# EasyEDA Pro project ProPrj_photodigm_mount_DB15_Edited_2025-06-26.epro

# Schematic photodigm_mount_DB15
Board Name: photodigm_mount_DB15; Create Date: 2025-06-18; Page Name: photodigm_mount_DB15; Project Name: photodigm_mount_DB15_Edited; Schematic Name: photodigm_mount_DB15; Update Date: 2025-06-19; File: photodigm_mount_DB15; Id: /; Sheet: /
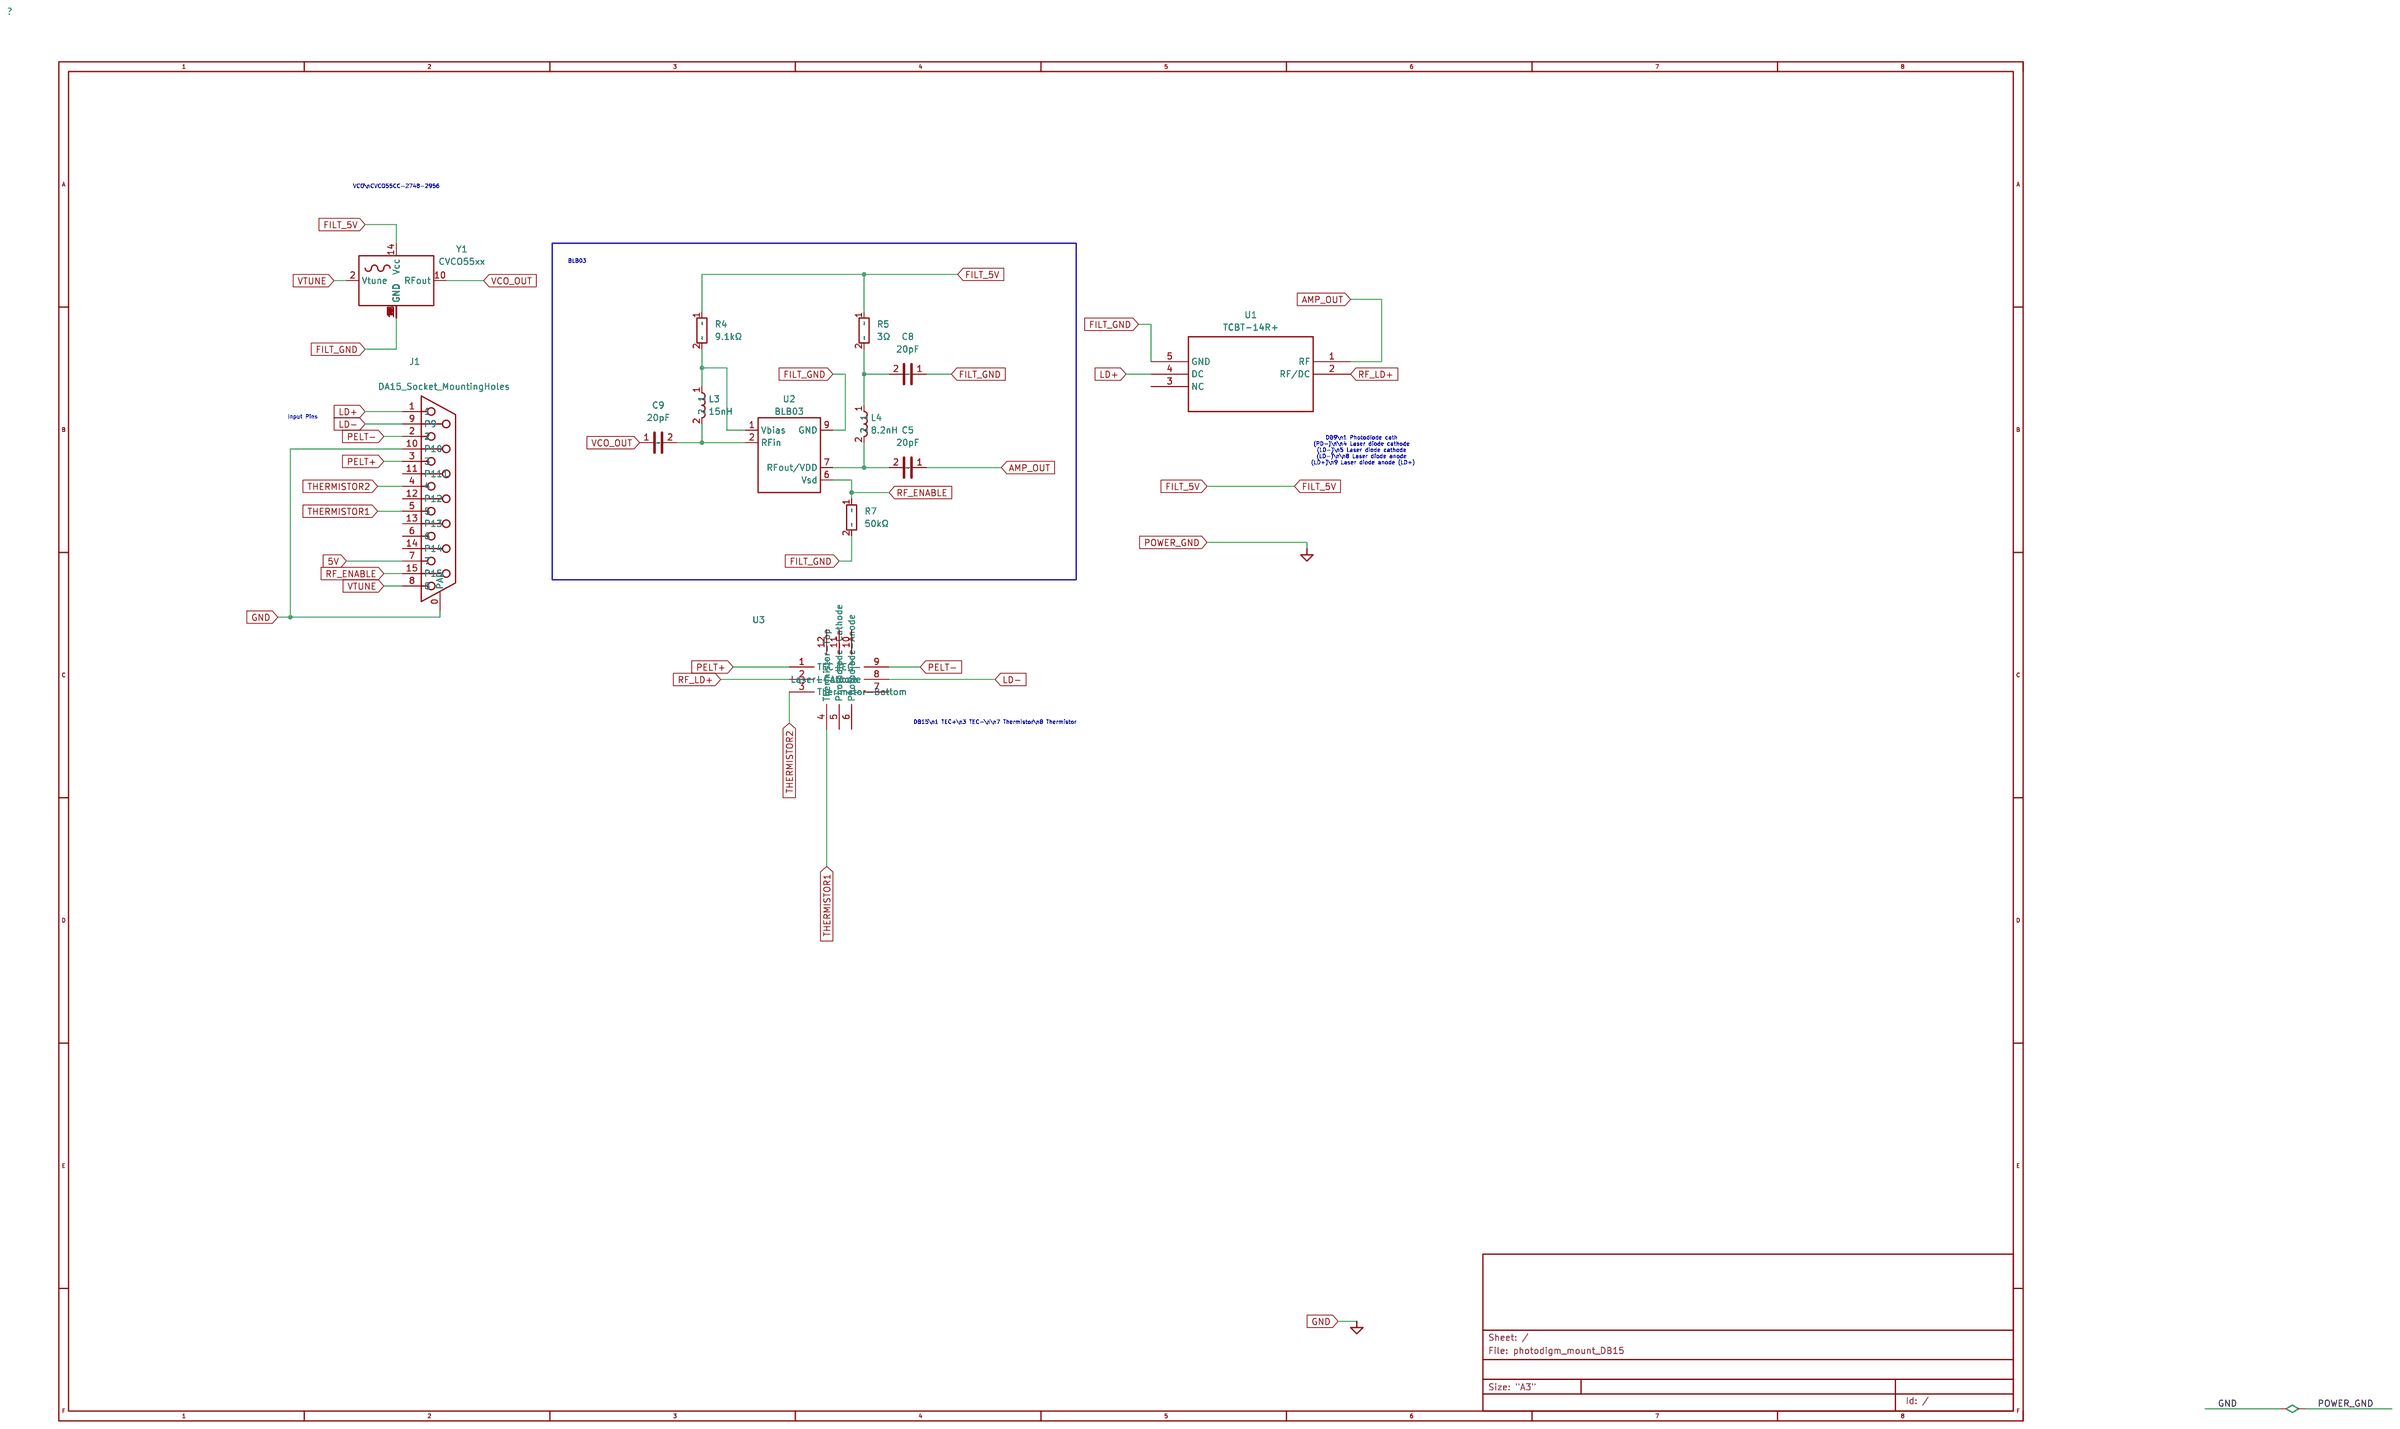
[diagram p0: schematic sheet]

## Parts
C5  20pF  [Capacitor_SMD:C_0402_1005Metric]
C8  20pF  [Capacitor_SMD:C_0402_1005Metric]
C9  20pF  [Capacitor_SMD:C_0402_1005Metric]
J1  DA15_Socket_MountingHoles  [Connector_Dsub:DSUB-15_Socket_Vertical_P2.77x2.84mm_MountingHoles]
L3  15nH  [Inductor_SMD:L_0603_1608Metric]
L4  8.2nH  [Inductor_SMD:L_0603_1608Metric]
R4  9.1kΩ  [Resistor_SMD:R_0402_1005Metric]
R5  3Ω  [Resistor_SMD:R_0402_1005Metric]
R7  50kΩ  [Resistor_SMD:R_0402_1005Metric]
U1  TCBT-14R+  [TCBT-14R+:GU1414-2_MNC]
U2  BLB03  [Package_DFN_QFN:DFN-8-1EP_2x2mm_P0.5mm_EP0.6x1.2mm]
U3  -  [LaserDiode]
Y1  CVCO55xx  [CVCO55CC-2745-2860:CVCO55CC-2745-2860_CRX-L]

## Library data of the parts
C5 C8 C9 = Device_C: Unpolarized capacitor; Users: REF**
J1 = Connector_DA15_Socket_MountingHoles: 15-pin D-SUB connector, socket (female) (low-density/2 columns), Mounting Hole; Users: REF**
L3 L4 = Device_L: Inductor; Users: REF**
R4 R5 R7 = Device_R: Resistor; Users: REF**
U1 = TCBT-14R+_TCBT-14R+: Users: REF**
U2 = andysymbols_BLB03: Users: REF**
U3 = LaserDiode: The pinout mapping to the laser diode is detailed here: / https://docs.google.com/document/d/1F_GS5lQfQVxQtG2fh0W02aLKUGq1590sdO3nVdWIJyE/edit?tab=t.0
Y1 = Oscillator_CVCO55xx: Voltage Controlled Oscillator, Crystek, 0.50\" SQ SMD; Users: *; datasheet: https://www.crystek.com/home/vco/cvco55.aspx; User doc link: https://www.crystek.com/home/vco/cvco55.aspx

## Nets
5V: J1.7
AMP_OUT: C5.1 U1.1(RF)
FILT_5V: R4.1 R5.1 Y1.14(Vcc)
FILT_GND: C8.1 R7.2 U1.5(GND) U2.9(GND) Y1.1(GND) Y1.3(GND) Y1.4(GND) Y1.5(GND) Y1.6(GND) Y1.7(GND) Y1.8(GND) Y1.9(GND) Y1.11(GND) Y1.12(GND) Y1.13(GND) Y1.15(GND) Y1.16(GND)
LD+: J1.1 U1.4(DC)
LD-: J1.9(P9) U3.8(Laser-Cathode)
PELT+: J1.3 U3.1(TEC+)
PELT-: J1.2 U3.9(TEC-)
POWER_GND: J1.0(PAD) J1.10(P10)
RF_ENABLE: J1.15(P15) R7.1 U2.6(Vsd)
RF_LD+: U1.2(RF/DC) U3.2(L-Anode)
THERMISTOR1: J1.5 U3.4(Thermistor-Top)
THERMISTOR2: J1.4 U3.3(Therimstor-Bottom)
VCO_OUT: C9.1 Y1.10(RFout)
VTUNE: J1.8 Y1.2(Vtune)
$1N4: C9.2 L3.2 U2.2(RFin)
$1N8: C8.2 L4.1 R5.2
$1N12: L3.1 R4.2 U2.1(Vbias)
$1N19: C5.2 L4.2 U2.7(RFout/VDD)

Not connected (* = marked no-connect by the designer): J1 6 11(P111) 12(P12) 13(P13) 14(P14); U1 3(NC); U3 5(Photodiode-Cathode) 6(Photodiode-Anode) 7(--) 10(--) 11(--) 12(--)

## Notes on the sheet
- VCO\nCVCO55CC-2748-2956
- BLB03
- Input Pins
- DB9\n1 Photodiode cath
  (PD-)\n\n4 Laser diode cathode
  (LD-)\n5 Laser diode cathode
  (LD-)\n\n8 Laser diode anode
  (LD+)\n9 Laser diode anode (LD+)
- DB15\n1 TEC+\n3 TEC-\n\n7 Thermistor\n8 Thermistor

# Board photodigm_mount_DB15
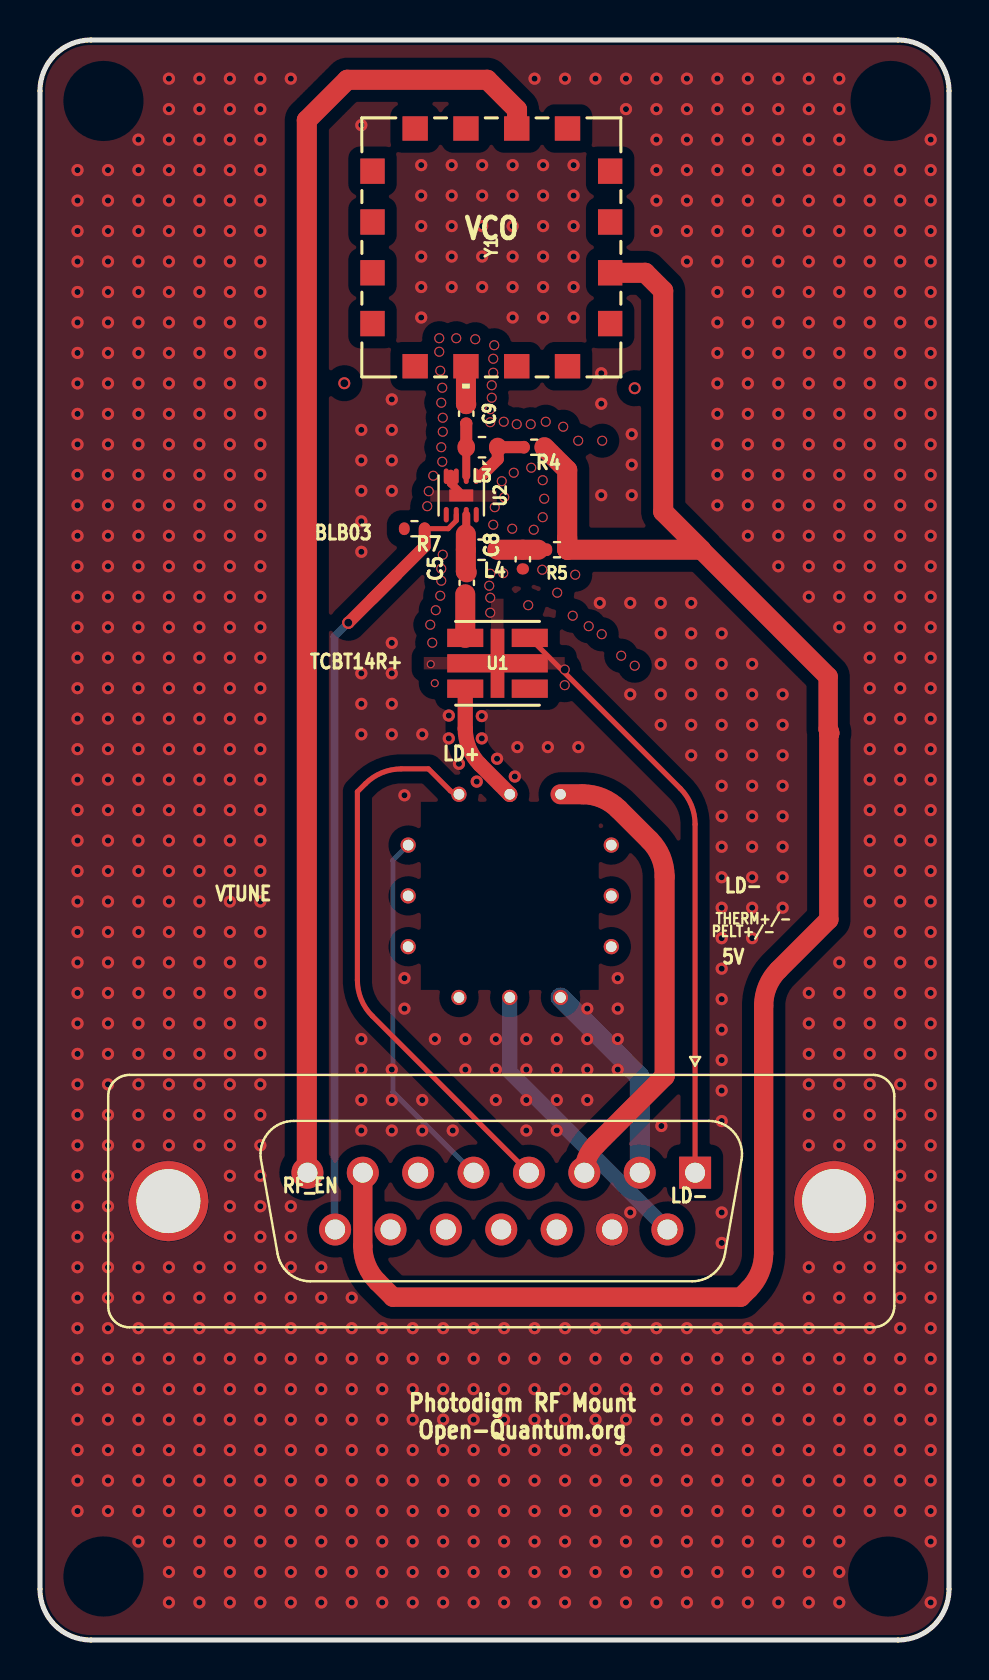
[diagram p1: board, top side]
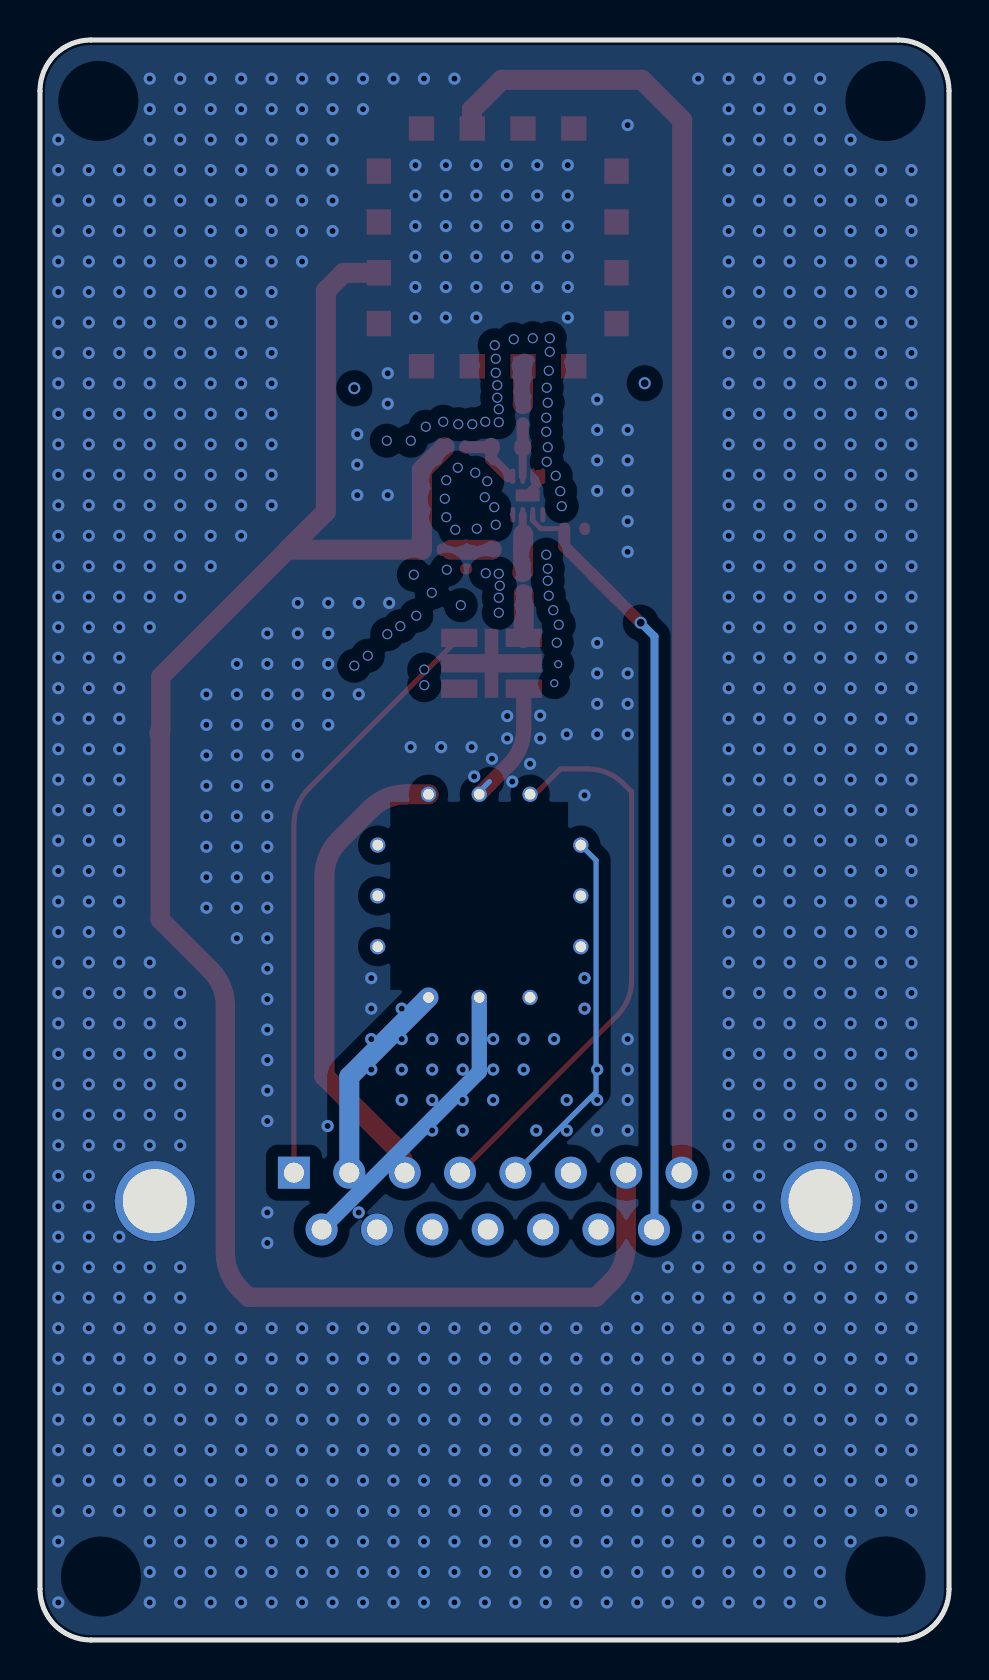
[diagram p2: board, bottom side, seen from below]

Outline 45.47 x 80.01 mm; copper layers: Top Layer, Bottom Layer. Coordinates in mm from the lower left corner of the outline.
Outline path: 0,77.47 0,2.54 arc(0.74,0.74) 2.54,0 42.93,0 arc(44.72,0.74) 45.47,2.54 45.47,77.47 arc(44.72,79.27) 42.93,80.01 2.54,80.01 arc(0.74,79.27) 0,77.47
Stack: Top Layer 0.035mm / Dielectric1 1.51mm FR4 er 4.5 / Bottom Layer 0.035mm

## Design rules (mm)
template: User Custom Config
spacing safeClearance (default): track to track 0, other pairs 0 to 0.051
track width trackWidth (default): min 0.127, default 0.254, max 2.54
differential pair differentialPair (default): width min 0.127, default 0.254, max 2.54; gap min 0.152, default 0.152
via viaSize (default): diameter min 0.5, default 0.61, max 10; hole min 0.3, default 0.305, max 5.999
net filt_gnd uses CopperRegion1

## Placement (name value [footprint] x y rotation side)
C5  20pF  [Capacitor_SMD:C_0402_1005Metric]  21.34 52.87 90 top
C8  20pF  [Capacitor_SMD:C_0402_1005Metric]  24.15 54.04 90 top
C9  20pF  [Capacitor_SMD:C_0402_1005Metric]  21.32 61.32 270 top
J1  DA15_Socket_MountingHoles  [Connector_Dsub:DSUB-15_Socket_Vertical_P2.77x2.84mm_MountingHoles]  32.77 23.37 0 top
L3  15nH  [Inductor_SMD:L_0603_1608Metric]  22.11 59.65 180 top
L4  8.2nH  [Inductor_SMD:L_0603_1608Metric]  22.09 54.52 180 top
R4  9.1kΩ  [Resistor_SMD:R_0402_1005Metric]  24.72 59.65 180 top
R5  3Ω  [Resistor_SMD:R_0402_1005Metric]  25.86 54.52 180 top
R7  50kΩ  [Resistor_SMD:R_0402_1005Metric]  18.73 55.57 180 top
U1  TCBT-14R+  [TCBT-14R+:GU1414-2_MNC]  22.88 48.84 0 top
U2  BLB03  [Package_DFN_QFN:DFN-8-1EP_2x2mm_P0.5mm_EP0.6x1.2mm]  21.07 57.23 270 top
U3  -  [LaserDiode]  16.38 45.34 270 top
Y1  CVCO55xx  [CVCO55CC-2745-2860:CVCO55CC-2745-2860_CRX-L]  22.58 69.64 270 top

## Footprints (pads in the part's own frame, mm; a bottom-side part is the same pattern mirrored in y, then rotated)
Capacitor_SMD:C_0402_1005Metric
  rrect 0.56x0.62 smd: 1(-0.48,0) 2(0.48,0)
Connector_Dsub:DSUB-15_Socket_Vertical_P2.77x2.84mm_MountingHoles
  round 4 hole 3.2: 0(-26.345,-1.42) 0(6.955,-1.42)
  rect 1.6x1.6 hole 1: 1(0,0)
  round 1.6 hole 1: 2(-2.77,0) 3(-5.54,0) 4(-8.31,0) 5(-11.08,0) 6(-13.85,0) 7(-16.62,0) 8(-19.39,0) 9(-1.385,-2.84) 10(-4.155,-2.84) 11(-6.925,-2.84) 12(-9.695,-2.84) 13(-12.465,-2.84) 14(-15.235,-2.84) 15(-18.005,-2.84)
CVCO55CC-2745-2860:CVCO55CC-2745-2860_CRX-L
  rect 1.219x1.27 smd: 1(-5.944,3.81) 2(-5.944,1.27) 3(-5.944,-1.27) 4(-5.944,-3.81) 9(5.944,-3.81) 10(5.944,-1.27) 11(5.944,1.27) 12(5.944,3.81)
  rect 1.27x1.219 smd: 5(-3.81,-5.944) 6(-1.27,-5.944) 7(1.27,-5.944) 8(3.81,-5.944) 13(3.81,5.944) 14(1.27,5.944) 15(-1.27,5.944) 16(-3.81,5.944)
Inductor_SMD:L_0603_1608Metric
  rrect 0.875x0.95 smd: 1(-0.787,0) 2(0.787,0)
LaserDiode
  round 0.762 hole 0.533: 1(3.048,9.652) 2(3.048,7.112) 3(3.048,4.572) 4(5.588,2.032) 5(8.128,2.032) 6(10.668,2.032) 7(13.208,4.572) 8(13.208,7.112) 9(13.208,9.652) 10(10.668,12.192) 11(8.128,12.192) 12(5.588,12.192)
Package_DFN_QFN:DFN-8-1EP_2x2mm_P0.5mm_EP0.6x1.2mm
  rrect 0.24x0.48 smd: (-0.15,0.3) (-0.15,-0.3) (0.15,0.3) (0.15,-0.3)
  rrect 0.775x0.25 smd: 1(-0.963,0.75) 2(-0.963,0.25) 3(-0.963,-0.25) 4(-0.963,-0.75) 5(0.963,-0.75) 6(0.963,-0.25) 7(0.963,0.25) 8(0.963,0.75)
  rect 0.6x1.2 smd: 9(0,0)
Resistor_SMD:R_0402_1005Metric
  rrect 0.54x0.64 smd: 1(-0.51,0) 2(0.51,0)
TCBT-14R+:GU1414-2_MNC
  rect 1.804x0.914 smd: 1(-1.613,1.27) 2(-1.613,-1.27) 3(1.613,-1.27) 4(1.613,1.27)
  rect 0.686x3.454 smd: 5(0,0)

## Nets
As in the schematic, except:
GND: J1.0 J1.10

Pads without a net: J1 6 11 12 13 14; U1 3; U2 3 4 5 8; U3 5 6 7 10 11 12

## Via types
v1: diameter 0.61, hole 0.305, Top Layer to Bottom Layer, 943 vias
v2: diameter 0.5, hole 0.4, Top Layer to Bottom Layer, 62 vias
v3: diameter 0.4, hole 0.3, Top Layer to Bottom Layer, 2 vias
v4: diameter 0.6, hole 0.4, Top Layer to Bottom Layer, 3 vias

## Routing (per net, layer and track width the routed paths; a pad name or vN(x,y) marks a point on that pad's centre or on a via; arc(x,y) is an arc through that point)
5V: length 94.8
  Top Layer w0.965: J1.7 16.15,19.7 arc(16.34,18.73) 16.89,17.91 17.65,17.14 35.05,17.14 35.45,17.54 arc(36,18.37) 36.2,19.34 36.2,31.71 arc(36.39,32.69) 36.94,33.51 39.45,36.03 39.45,45.3 39.5,45.34 39.5,45.36 arc(39.48,45.46) 39.42,45.55 39.42,48.17 33.07,54.52
  Top Layer w1: 25.23,59.65 26.37,58.5 26.37,54.52 33.07,54.52 31.17,56.42 31.17,67.47 30.27,68.37 28.52,68.37
GND:
  vias: v1(1.88,73.5) v1(1.88,71.98) v1(1.88,70.46) v1(1.88,68.93) v1(1.88,67.41) v1(1.88,65.88) v1(1.88,64.36) v1(1.88,62.84) v1(1.88,61.31) v1(1.88,59.79) v1(1.88,58.26) v1(1.88,56.74) v1(1.88,55.22) v1(1.88,53.69) v1(1.88,52.17) v1(1.88,50.64) v1(1.88,49.12) v1(1.88,47.6) v1(1.88,46.07) v1(1.88,44.55) v1(1.88,43.02) v1(1.88,41.5) v1(1.88,39.98) v1(1.88,38.45) v1(1.88,36.93) v1(1.88,35.4) v1(1.88,33.88) v1(1.88,32.36) v1(1.88,30.83) v1(1.88,29.31) v1(1.88,27.78) v1(1.88,26.26) v1(1.88,24.74) v1(1.88,23.21) v1(1.88,21.69) v1(1.88,20.16) v1(1.88,18.64) v1(1.88,17.12) v1(1.88,15.59) v1(1.88,14.07) v1(1.88,12.54) v1(1.88,11.02) v1(1.88,9.5) v1(1.88,7.97) v1(1.88,6.45) v1(3.4,73.5) v1(3.4,71.98) v1(3.4,70.46) v1(3.4,68.93) v1(3.4,67.41) v1(3.4,65.88) v1(3.4,64.36) v1(3.4,62.84) v1(3.4,61.31) v1(3.4,59.79) v1(3.4,58.26) v1(3.4,56.74) v1(3.4,55.22) v1(3.4,53.69) v1(3.4,52.17) v1(3.4,50.64) v1(3.4,49.12) v1(3.4,47.6) v1(3.4,46.07) v1(3.4,44.55) v1(3.4,43.02) v1(3.4,41.5) v1(3.4,39.98) v1(3.4,38.45) v1(3.4,36.93) v1(3.4,35.4) v1(3.4,33.88) v1(3.4,32.36) v1(3.4,30.83) v1(3.4,29.31) v1(3.4,27.78) v1(3.4,26.26) v1(3.4,24.74) v1(3.4,23.21) v1(3.4,21.69) v1(3.4,20.16) v1(3.4,18.64) v1(3.4,17.12) v1(3.4,15.59) v1(3.4,14.07) v1(3.4,12.54) v1(3.4,11.02) v1(3.4,9.5) v1(3.4,7.97) v1(3.4,6.45) v1(4.92,75.03) v1(4.92,73.5) v1(4.92,71.98) v1(4.92,70.46) v1(4.92,68.93) v1(4.92,67.41) v1(4.92,65.88) v1(4.92,64.36) v1(4.92,62.84) v1(4.92,61.31) v1(4.92,59.79) v1(4.92,58.26) v1(4.92,56.74) v1(4.92,55.22) v1(4.92,53.69) v1(4.92,52.17) v1(4.92,50.64) v1(4.92,49.12) v1(4.92,47.6) v1(4.92,46.07) v1(4.92,44.55) v1(4.92,43.02) v1(4.92,41.5) v1(4.92,39.98) v1(4.92,38.45) v1(4.92,36.93) v1(4.92,35.4) v1(4.92,33.88) v1(4.92,32.36) v1(4.92,30.83) v1(4.92,29.31) v1(4.92,27.78) v1(4.92,26.26) v1(4.92,24.74) v1(4.92,18.64) v1(4.92,17.12) v1(4.92,15.59) v1(4.92,14.07) v1(4.92,12.54) v1(4.92,11.02) v1(4.92,9.5) v1(4.92,7.97) v1(4.92,6.45) v1(4.92,4.92) v1(6.45,78.08) v1(6.45,76.55) v1(6.45,75.03) v1(6.45,73.5) v1(6.45,71.98) v1(6.45,70.46) v1(6.45,68.93) v1(6.45,67.41) v1(6.45,65.88) v1(6.45,64.36) v1(6.45,62.84) v1(6.45,61.31) v1(6.45,59.79) v1(6.45,58.26) v1(6.45,56.74) v1(6.45,55.22) v1(6.45,53.69) v1(6.45,52.17) v1(6.45,50.64) v1(6.45,49.12) v1(6.45,47.6) v1(6.45,46.07) v1(6.45,44.55) v1(6.45,43.02) v1(6.45,41.5) v1(6.45,39.98) v1(6.45,38.45) v1(6.45,36.93) v1(6.45,35.4) v1(6.45,33.88) v1(6.45,32.36) v1(6.45,30.83) v1(6.45,29.31) v1(6.45,27.78) v1(6.45,26.26) v1(6.45,24.74) v1(6.45,18.64) v1(6.45,17.12) v1(6.45,15.59) v1(6.45,14.07) v1(6.45,12.54) v1(6.45,11.02) v1(6.45,9.5) v1(6.45,7.97) v1(6.45,6.45) v1(6.45,4.92) v1(6.45,3.4) v1(6.45,1.88) v1(7.97,78.08) v1(7.97,76.55) v1(7.97,75.03) v1(7.97,73.5) v1(7.97,71.98) v1(7.97,70.46) v1(7.97,68.93) v1(7.97,67.41) v1(7.97,65.88) v1(7.97,64.36) v1(7.97,62.84) v1(7.97,61.31) v1(7.97,59.79) v1(7.97,58.26) v1(7.97,56.74) v1(7.97,55.22) v1(7.97,53.69) v1(7.97,52.17) v1(7.97,50.64) v1(7.97,49.12) v1(7.97,47.6) v1(7.97,46.07) v1(7.97,44.55) v1(7.97,43.02) v1(7.97,41.5) v1(7.97,39.98) v1(7.97,38.45) v1(7.97,36.93) v1(7.97,35.4) v1(7.97,33.88) v1(7.97,32.36) v1(7.97,30.83) v1(7.97,29.31) v1(7.97,27.78) v1(7.97,26.26) v1(7.97,24.74) v1(7.97,18.64) v1(7.97,17.12) v1(7.97,15.59) v1(7.97,14.07) v1(7.97,12.54) v1(7.97,11.02) v1(7.97,9.5) v1(7.97,7.97) v1(7.97,6.45) v1(7.97,4.92) v1(7.97,3.4) v1(7.97,1.88) v1(9.5,78.08) v1(9.5,76.55) v1(9.5,75.03) v1(9.5,73.5) v1(9.5,71.98) v1(9.5,70.46) v1(9.5,68.93) v1(9.5,67.41) v1(9.5,65.88) v1(9.5,64.36) v1(9.5,62.84) v1(9.5,61.31) v1(9.5,59.79) v1(9.5,58.26) v1(9.5,56.74) v1(9.5,55.22) v1(9.5,53.69) v1(9.5,52.17) v1(9.5,50.64) v1(9.5,49.12) v1(9.5,47.6) v1(9.5,46.07) v1(9.5,44.55) v1(9.5,43.02) v1(9.5,41.5) v1(9.5,39.98) v1(9.5,38.45) v1(9.5,36.93) v1(9.5,35.4) v1(9.5,33.88) v1(9.5,32.36) v1(9.5,30.83) v1(9.5,29.31) v1(9.5,27.78) v1(9.5,26.26) v1(9.5,24.74) v1(9.5,23.21) v1(9.5,21.69) v1(9.5,20.16) v1(9.5,18.64) v1(9.5,17.12) v1(9.5,15.59) v1(9.5,14.07) v1(9.5,12.54) v1(9.5,11.02) v1(9.5,9.5) v1(9.5,7.97) v1(9.5,6.45) v1(9.5,4.92) v1(9.5,3.4) v1(9.5,1.88) v1(11.02,78.08) v1(11.02,76.55) v1(11.02,75.03) v1(11.02,73.5) v1(11.02,71.98) v1(11.02,70.46) v1(11.02,68.93) v1(11.02,67.41) v1(11.02,65.88) v1(11.02,64.36) v1(11.02,62.84) v1(11.02,61.31) v1(11.02,59.79) v1(11.02,58.26) v1(11.02,56.74) v1(11.02,55.22) v1(11.02,53.69) v1(11.02,52.17) v1(11.02,50.64) v1(11.02,49.12) v1(11.02,47.6) v1(11.02,46.07) v1(11.02,44.55) v1(11.02,43.02) v1(11.02,41.5) v1(11.02,39.98) v1(11.02,38.45) v1(11.02,36.93) v1(11.02,35.4) v1(11.02,33.88) v1(11.02,32.36) v1(11.02,30.83) v1(11.02,29.31) v1(11.02,27.78) v1(11.02,26.26) v1(11.02,24.74) v1(11.02,23.21) v1(11.02,21.69) v1(11.02,20.16) v1(11.02,18.64) v1(11.02,17.12) v1(11.02,15.59) v1(11.02,14.07) v1(11.02,12.54) v1(11.02,11.02) v1(11.02,9.5) v1(11.02,7.97) v1(11.02,6.45) v1(11.02,4.92) v1(11.02,3.4) v1(11.02,1.88) v1(12.55,78.08) v1(12.55,21.69) v1(12.55,20.16) v1(12.55,18.64) v1(12.55,17.12) v1(12.55,15.59) v1(12.55,14.07) v1(12.55,12.54) v1(12.55,11.02) v1(12.55,9.5) v1(12.55,7.97) v1(12.55,6.45) v1(12.55,4.92) v1(12.55,3.4) v1(12.55,1.88) v1(14.07,18.64) v1(14.07,17.12) v1(14.07,15.59) v1(14.07,14.07) v1(14.07,12.54) v1(14.07,11.02) v1(14.07,9.5) v1(14.07,7.97) v1(14.07,6.45) v1(14.07,4.92) v1(14.07,3.4) v1(14.07,1.88) v1(15.59,17.12) v1(15.59,15.59) v1(15.59,14.07) v1(15.59,12.54) v1(15.59,11.02) v1(15.59,9.5) v1(15.59,7.97) v1(15.59,6.45) v1(15.59,4.92) v1(15.59,3.4) v1(15.59,1.88) v1(16.07,75.75) v1(16.07,60.51) v1(16.07,58.99) v1(16.07,57.46) v1(16.07,55.94) v1(16.07,54.42) v1(16.07,48.34) v1(16.07,46.81) v1(16.07,45.29) v1(16.07,30.05) v1(16.07,28.53) v1(16.07,27) v1(16.07,25.48) v1(17.12,15.59) v1(17.12,14.07) v1(17.12,12.54) v1(17.12,11.02) v1(17.12,9.5) v1(17.12,7.97) v1(17.12,6.45) v1(17.12,4.92) v1(17.12,3.4) v1(17.12,1.88) v1(17.6,62.04) v1(17.6,60.51) v1(17.6,58.99) v1(17.6,57.46) v1(17.6,49.86) v1(17.6,48.34) v1(17.6,46.81) v1(17.6,45.29) v1(17.6,28.53) v1(17.6,27) v1(17.6,25.48) v1(18.23,42.24) v1(18.23,33.1) v1(18.23,31.57) v1(18.64,15.59) v1(18.64,14.07) v1(18.64,12.54) v1(18.64,11.02) v1(18.64,9.5) v1(18.64,7.97) v1(18.64,6.45) v1(18.64,4.92) v1(18.64,3.4) v1(18.64,1.88) v1(19.07,73.75) v1(19.07,72.23) v1(19.07,70.7) v1(19.07,69.18) v1(19.07,67.66) v1(19.07,66.13) v1(19.12,45.29) v1(19.12,27) v1(19.12,25.48) v1(19.75,30.05) v1(20.17,15.59) v1(20.17,14.07) v1(20.17,12.54) v1(20.17,11.02) v1(20.17,9.5) v1(20.17,7.97) v1(20.17,6.45) v1(20.17,4.92) v1(20.17,3.4) v1(20.17,1.88) v1(20.45,46.23) v1(20.45,45.08) v1(20.59,73.75) v1(20.59,72.23) v1(20.59,70.7) v1(20.59,69.18) v1(20.59,67.66) v1(20.64,25.48) v1(20.95,43.81) v1(21.28,30.05) v1(21.28,28.53) v1(21.69,15.59) v1(21.69,14.07) v1(21.69,12.54) v1(21.69,11.02) v1(21.69,9.5) v1(21.69,7.97) v1(21.69,6.45) v1(21.69,4.92) v1(21.69,3.4) v1(21.69,1.88) v1(21.84,42.93) v1(22.12,73.75) v1(22.12,72.23) v1(22.12,70.7) v1(22.12,69.18) v1(22.12,67.66) v1(22.1,46.2) v1(22.1,45.08) v1(22.86,44.07) v1(22.8,30.05) v1(22.8,28.53) v1(22.8,27) v1(23.21,15.59) v1(23.21,14.07) v1(23.21,12.54) v1(23.21,11.02) v1(23.21,9.5) v1(23.21,7.97) v1(23.21,6.45) v1(23.21,4.92) v1(23.21,3.4) v1(23.21,1.88) v1(23.64,73.75) v1(23.64,72.23) v1(23.64,70.7) v1(23.64,69.18) v1(23.64,67.66) v1(23.64,66.13) v1(23.75,43.18) v1(23.88,44.65) v1(24.33,30.05) v1(24.33,28.53) v1(24.33,27) v1(24.33,25.48) v1(24.74,78.08) v1(24.74,15.59) v1(24.74,14.07) v1(24.74,12.54) v1(24.74,11.02) v1(24.74,9.5) v1(24.74,7.97) v1(24.74,6.45) v1(24.74,4.92) v1(24.74,3.4) v1(24.74,1.88) v1(25.16,73.75) v1(25.16,72.23) v1(25.16,70.7) v1(25.16,69.18) v1(25.16,67.66) v1(25.16,66.13) v1(25.4,44.65) v1(25.85,30.05) v1(25.85,28.53) v1(25.85,27) v1(25.85,25.48) v1(26.26,78.08) v1(26.26,15.59) v1(26.26,14.07) v1(26.26,12.54) v1(26.26,11.02) v1(26.26,9.5) v1(26.26,7.97) v1(26.26,6.45) v1(26.26,4.92) v1(26.26,3.4) v1(26.26,1.88) v1(26.69,73.75) v1(26.69,72.23) v1(26.69,70.7) v1(26.69,69.18) v1(26.69,67.66) v1(26.69,66.13) v1(26.93,44.65) v1(27.37,31.57) v1(27.37,30.05) v1(27.37,28.53) v1(27.37,27) v1(27.78,78.08) v1(27.78,15.59) v1(27.78,14.07) v1(27.78,12.54) v1(27.78,11.02) v1(27.78,9.5) v1(27.78,7.97) v1(27.78,6.45) v1(27.78,4.92) v1(27.78,3.4) v1(27.78,1.88) v1(28,51.86) v1(28.07,63.34) v1(28.07,61.82) v1(28.07,57.25) v1(28.9,33.1) v1(28.9,31.57) v1(28.9,30.05) v1(28.9,28.53) v1(29.31,78.08) v1(29.31,76.55) v1(29.31,15.59) v1(29.31,14.07) v1(29.31,12.54) v1(29.31,11.02) v1(29.31,9.5) v1(29.31,7.97) v1(29.31,6.45) v1(29.31,4.92) v1(29.31,3.4) v1(29.31,1.88) v1(29.52,51.86) v1(29.52,47.29) v1(29.52,21.38) v1(29.6,60.3) v1(29.6,58.77) v1(29.6,57.25) v1(30.83,78.08) v1(30.83,76.55) v1(30.83,75.03) v1(30.83,73.5) v1(30.83,71.98) v1(30.83,70.46) v1(30.83,15.59) v1(30.83,14.07) v1(30.83,12.54) v1(30.83,11.02) v1(30.83,9.5) v1(30.83,7.97) v1(30.83,6.45) v1(30.83,4.92) v1(30.83,3.4) v1(30.83,1.88) v1(31.05,51.86) v1(31.05,50.33) v1(31.05,48.81) v1(31.05,47.29) v1(31.05,45.76) v1(31.08,25.7) v1(32.36,78.08) v1(32.36,76.55) v1(32.36,75.03) v1(32.36,73.5) v1(32.36,71.98) v1(32.36,70.46) v1(32.36,68.93) v1(32.36,15.59) v1(32.36,14.07) v1(32.36,12.54) v1(32.36,11.02) v1(32.36,9.5) v1(32.36,7.97) v1(32.36,6.45) v1(32.36,4.92) v1(32.36,3.4) v1(32.36,1.88) v1(32.57,51.86) v1(32.57,50.33) v1(32.57,48.81) v1(32.57,47.29) v1(32.57,45.76) v1(32.57,44.24) v1(33.88,78.08) v1(33.88,76.55) v1(33.88,75.03) v1(33.88,73.5) v1(33.88,71.98) v1(33.88,70.46) v1(33.88,68.93) v1(33.88,67.41) v1(33.88,65.88) v1(33.88,64.36) v1(33.88,62.84) v1(33.88,61.31) v1(33.88,59.79) v1(33.88,58.26) v1(33.88,56.74) v1(33.88,15.59) v1(33.88,14.07) v1(33.88,12.54) v1(33.88,11.02) v1(33.88,9.5) v1(33.88,7.97) v1(33.88,6.45) v1(33.88,4.92) v1(33.88,3.4) v1(33.88,1.88) v1(34.1,50.33) v1(34.1,48.81) v1(34.1,47.29) v1(34.1,45.76) v1(34.1,44.24) v1(34.1,42.71) v1(34.1,41.19) v1(34.1,39.67) v1(34.1,38.14) v1(34.1,36.62) v1(34.1,35.09) v1(34.1,33.57) v1(34.1,32.05) v1(34.1,30.52) v1(34.1,29) v1(34.1,27.47) v1(34.1,25.95) v1(34.1,21.38) v1(34.1,19.85) v1(35.4,78.08) v1(35.4,76.55) v1(35.4,75.03) v1(35.4,73.5) v1(35.4,71.98) v1(35.4,70.46) v1(35.4,68.93) v1(35.4,67.41) v1(35.4,65.88) v1(35.4,64.36) v1(35.4,62.84) v1(35.4,61.31) v1(35.4,59.79) v1(35.4,58.26) v1(35.4,56.74) v1(35.4,55.22) v1(35.4,15.59) v1(35.4,14.07) v1(35.4,12.54) v1(35.4,11.02) v1(35.4,9.5) v1(35.4,7.97) v1(35.4,6.45) v1(35.4,4.92) v1(35.4,3.4) v1(35.4,1.88) v1(35.62,48.81) v1(35.62,47.29) v1(35.62,45.76) v1(35.62,44.24) v1(35.62,42.71) v1(35.62,41.19) v1(35.62,39.67) v1(35.62,38.14) v1(35.62,36.62) v1(35.62,35.09) v1(36.93,78.08) v1(36.93,76.55) v1(36.93,75.03) v1(36.93,73.5) v1(36.93,71.98) v1(36.93,70.46) v1(36.93,68.93) v1(36.93,67.41) v1(36.93,65.88) v1(36.93,64.36) v1(36.93,62.84) v1(36.93,61.31) v1(36.93,59.79) v1(36.93,58.26) v1(36.93,56.74) v1(36.93,55.22) v1(36.93,53.69) v1(36.93,15.59) v1(36.93,14.07) v1(36.93,12.54) v1(36.93,11.02) v1(36.93,9.5) v1(36.93,7.97) v1(36.93,6.45) v1(36.93,4.92) v1(36.93,3.4) v1(36.93,1.88) v1(37.14,47.29) v1(37.14,45.76) v1(37.14,44.24) v1(37.14,42.71) v1(37.14,41.19) v1(37.14,39.67) v1(37.14,38.14) v1(37.14,36.62) v1(38.45,78.08) v1(38.45,76.55) v1(38.45,75.03) v1(38.45,73.5) v1(38.45,71.98) v1(38.45,70.46) v1(38.45,68.93) v1(38.45,67.41) v1(38.45,65.88) v1(38.45,64.36) v1(38.45,62.84) v1(38.45,61.31) v1(38.45,59.79) v1(38.45,58.26) v1(38.45,56.74) v1(38.45,55.22) v1(38.45,53.69) v1(38.45,52.17) v1(38.45,32.36) v1(38.45,30.83) v1(38.45,29.31) v1(38.45,27.78) v1(38.45,26.26) v1(38.45,24.74) v1(38.45,18.64) v1(38.45,17.12) v1(38.45,15.59) v1(38.45,14.07) v1(38.45,12.54) v1(38.45,11.02) v1(38.45,9.5) v1(38.45,7.97) v1(38.45,6.45) v1(38.45,4.92) v1(38.45,3.4) v1(38.45,1.88) v1(39.98,78.08) v1(39.98,76.55) v1(39.98,75.03) v1(39.98,73.5) v1(39.98,71.98) v1(39.98,70.46) v1(39.98,68.93) v1(39.98,67.41) v1(39.98,65.88) v1(39.98,64.36) v1(39.98,62.84) v1(39.98,61.31) v1(39.98,59.79) v1(39.98,58.26) v1(39.98,56.74) v1(39.98,55.22) v1(39.98,53.69) v1(39.98,52.17) v1(39.98,50.64) v1(39.98,33.88) v1(39.98,32.36) v1(39.98,30.83) v1(39.98,29.31) v1(39.98,27.78) v1(39.98,26.26) v1(39.98,24.74) v1(39.98,18.64) v1(39.98,17.12) v1(39.98,15.59) v1(39.98,14.07) v1(39.98,12.54) v1(39.98,11.02) v1(39.98,9.5) v1(39.98,7.97) v1(39.98,6.45) v1(39.98,4.92) v1(39.98,3.4) v1(39.98,1.88) v1(41.5,73.5) v1(41.5,71.98) v1(41.5,70.46) v1(41.5,68.93) v1(41.5,67.41) v1(41.5,65.88) v1(41.5,64.36) v1(41.5,62.84) v1(41.5,61.31) v1(41.5,59.79) v1(41.5,58.26) v1(41.5,56.74) v1(41.5,55.22) v1(41.5,53.69) v1(41.5,52.17) v1(41.5,50.64) v1(41.5,49.12) v1(41.5,47.6) v1(41.5,46.07) v1(41.5,44.55) v1(41.5,43.02) v1(41.5,41.5) v1(41.5,39.98) v1(41.5,38.45) v1(41.5,36.93) v1(41.5,35.4) v1(41.5,33.88) v1(41.5,32.36) v1(41.5,30.83) v1(41.5,29.31) v1(41.5,27.78) v1(41.5,26.26) v1(41.5,24.74) v1(41.5,20.16) v1(41.5,18.64) v1(41.5,17.12) v1(41.5,15.59) v1(41.5,14.07) v1(41.5,12.54) v1(41.5,11.02) v1(41.5,9.5) v1(41.5,7.97) v1(41.5,6.45) v1(43.02,73.5) v1(43.02,71.98) v1(43.02,70.46) v1(43.02,68.93) v1(43.02,67.41) v1(43.02,65.88) v1(43.02,64.36) v1(43.02,62.84) v1(43.02,61.31) v1(43.02,59.79) v1(43.02,58.26) v1(43.02,56.74) v1(43.02,55.22) v1(43.02,53.69) v1(43.02,52.17) v1(43.02,50.64) v1(43.02,49.12) v1(43.02,47.6) v1(43.02,46.07) v1(43.02,44.55) v1(43.02,43.02) v1(43.02,41.5) v1(43.02,39.98) v1(43.02,38.45) v1(43.02,36.93) v1(43.02,35.4) v1(43.02,33.88) v1(43.02,32.36) v1(43.02,30.83) v1(43.02,29.31) v1(43.02,27.78) v1(43.02,26.26) v1(43.02,24.74) v1(43.02,23.21) v1(43.02,21.69) v1(43.02,20.16) v1(43.02,18.64) v1(43.02,17.12) v1(43.02,15.59) v1(43.02,14.07) v1(43.02,12.54) v1(43.02,11.02) v1(43.02,9.5) v1(43.02,7.97) v1(43.02,6.45) v1(44.55,75.03) v1(44.55,73.5) v1(44.55,71.98) v1(44.55,70.46) v1(44.55,68.93) v1(44.55,67.41) v1(44.55,65.88) v1(44.55,64.36) v1(44.55,62.84) v1(44.55,61.31) v1(44.55,59.79) v1(44.55,58.26) v1(44.55,56.74) v1(44.55,55.22) v1(44.55,53.69) v1(44.55,52.17) v1(44.55,50.64) v1(44.55,49.12) v1(44.55,47.6) v1(44.55,46.07) v1(44.55,44.55) v1(44.55,43.02) v1(44.55,41.5) v1(44.55,39.98) v1(44.55,38.45) v1(44.55,36.93) v1(44.55,35.4) v1(44.55,33.88) v1(44.55,32.36) v1(44.55,30.83) v1(44.55,29.31) v1(44.55,27.78) v1(44.55,26.26) v1(44.55,24.74) v1(44.55,23.21) v1(44.55,21.69) v1(44.55,20.16) v1(44.55,18.64) v1(44.55,17.12) v1(44.55,15.59) v1(44.55,14.07) v1(44.55,12.54) v1(44.55,11.02) v1(44.55,9.5) v1(44.55,7.97) v1(44.55,6.45) v1(44.55,4.92) v1(44.55,1.88)
AMP_OUT: length 2.2
  Top Layer w1: 21.27,52.29 U1.1
FILT_5V: length 0.6
  Top Layer w1: R5.1 26.37,55.12
FILT_GND: length 1.4
  Top Layer w0.4: 20.55,58.32 20.55,57.85 21.18,57.21
  vias: v2(19.37,56.7) v2(19.45,57.45) v2(19.52,50.77) v2(19.62,49.87) v2(19.67,58.22) v2(19.8,51.5) v2(19.97,65.1) v2(19.97,64.42) v2(20.02,63.47) v2(20.02,52.22) v2(20.12,62.62) v2(20.07,61.87) v2(20.14,61.12) v2(20.14,60.42) v2(20.07,59.65) v2(20.12,58.92) v2(20.14,54.27) v2(20.07,53.57) v2(20.07,52.97) v2(20.82,65.1) v2(21.77,65.05) v2(22.47,52.72) v2(22.52,61.55) v2(22.52,60.9) v2(22.52,53.32) v2(22.52,52.12) v2(22.52,51.37) v2(22.59,62.75) v2(22.59,62.12) v2(22.72,64.75) v2(22.67,64.07) v2(22.67,63.37) v2(22.74,56.65) v2(22.67,55.77) v2(23.09,57.95) v2(23.2,60.92) v2(23.22,57.15) v2(23.17,53.35) v2(23.62,55.57) v2(23.7,58.37) v2(23.84,60.8) v2(24.42,51.75) v2(24.55,60.8) v2(24.57,58.62) v2(24.7,55.52) v2(25.14,58) v2(25.14,56.15) v2(25.12,53.52) v2(25.22,57.07) v2(25.3,60.92) v2(25.87,52.37) v2(26.17,60.67) v2(26.24,48.53) v2(26.24,47.75) v2(26.64,51.22) v2(26.77,53.27) v2(26.92,59.97) v2(27.45,50.7) v2(28.12,59.97) v2(28.09,50.3) v2(29.07,49.22) v2(29.74,48.72) v3(19.55,48.8) v3(19.74,47.85) v4(15.22,62.85) v4(29.74,62.6)
LD+: length 30.1
  Top Layer w0.254: J1.1 32.77,40.79 arc(32.57,41.76) 32.02,42.58 U1.4
LD-: length 14.9
  Bottom Layer w0.762: 31.38,20.53 23.49,28.41 U3.8
PELT+: length 23.7
  Top Layer w1.001: U3.1 27.14,42.29 arc(28.11,42.1) 28.94,41.55 30.5,39.99 arc(31.05,39.16) 31.24,38.19 31.24,28.19 27.8,24.75 arc(27.37,24.12) J1.3
PELT-: length 10.4
  Bottom Layer w1.001: J1.2 30,28.17 U3.9
RF_ENABLE: length 40.7
  Top Layer w0.25: R7.1 20.42,55.57 20.82,55.97 U2.6
  Top Layer w0.6: 16.62,52.06 17.83,53.27 ; 17.83,53.27 19.24,54.68 R7.1 ; 17.83,53.27 15.43,50.87 v4(15.42,50.87)
  Bottom Layer w0.4: v4(15.42,50.87) 14.73,50.18 14.73,20.56 J1.15
RF_LD+: length 7
  Top Layer w0.254: 21.34,47.5 U1.2
  Top Layer w0.762: U3.2 22.01,43.77 arc(21.46,44.6) 21.27,45.57 U1.2
  Bottom Layer w0.254: U3.2 23.49,42.42 22.99,42.93
THERMISTOR1: length 18.4
  Bottom Layer w0.254: U3.4 17.65,38.99 17.65,27.4 J1.5
THERMISTOR2: length 28.4
  Top Layer w0.254: J1.4 16.62,31.2 arc(16.07,32.03) 15.87,33 15.87,42.42 16.27,42.82 arc(17.1,43.37) 18.07,43.56 19.43,43.56 20.52,42.47 arc(20.72,42.34) U3.3
VCO_OUT: length 1.9
  Top Layer w1: Y1.10 21.3,61.82 C9.1
VTUNE: length 65.6
  Top Layer w1: J1.8 13.34,23.4 13.34,76 15.37,78.02 22.37,78.02 23.86,76.53 23.86,75.6 23.84,75.58
$1N4: length 2.6
  Top Layer w0.4: U2.2 L3.2
  Top Layer w0.6: C9.2 L3.2
$1N8: length 2
  Top Layer w1: L4.1 C8.2 24.92,54.52
$1N12: length 3.1
  Top Layer w0.6: 22.05,58.2 22.89,59.05 L3.1 R4.2
$1N19: length 2.4
  Top Layer w0.4: U2.7 21.32,55.75
  Top Layer w1: 21.3,55.29 L4.2 21.3,53.44 21.34,53.39

## Copper pours and planes (outline as drawn; the poured copper is in the pictures)
GND on Top Layer: -2.16,81.41 47.75,81.41 47.75,-3.81 -2.16,-3.81
GND on Bottom Layer: -8.13,82.04 51.69,82.04 51.69,-6.99 -8.13,-6.99
(no net) on Top Layer: 19.52,57.5 22.84,57.5 22.84,56.92 19.52,56.92

Small or netless copper shapes (teardrops, artwork), in the pictures only: 3 on Top Layer

## Text on the board
Top Silkscreen Layer: PELT+/- | THERM+/- | VTUNE | RF_EN | BLB03 | TCBT14R+ | LD+ | LD- | 5V | Photodigm RF Mount / Open-Quantum.org | VCO
